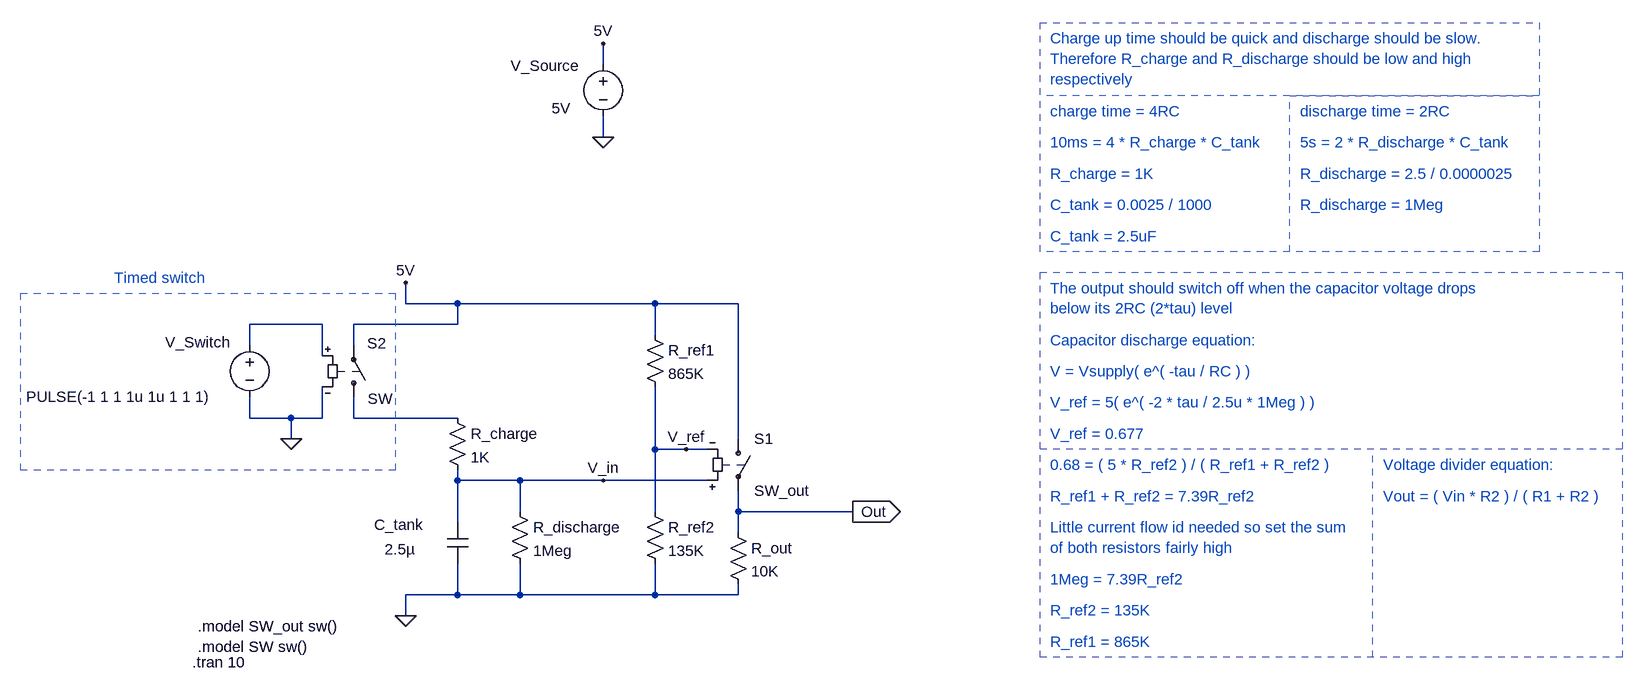
[diagram p0: schematic RC Timer.asc]
RC Timer.asc, the LTspice schematic file:
Version 4
SHEET 1 2388 756
WIRE 0 -480 0 -512
WIRE 0 -368 0 -400
WIRE -304 -112 -304 -144
WIRE -224 -112 -304 -112
WIRE 80 -112 -224 -112
WIRE 208 -112 80 -112
WIRE -432 -80 -544 -80
WIRE -224 -80 -224 -112
WIRE -224 -80 -384 -80
WIRE 80 -64 80 -112
WIRE -544 -48 -544 -80
WIRE -384 -48 -384 -80
WIRE -432 -32 -432 -80
WIRE -544 64 -544 32
WIRE -480 64 -544 64
WIRE -432 64 -432 16
WIRE -432 64 -480 64
WIRE -384 64 -384 32
WIRE -224 64 -384 64
WIRE -480 96 -480 64
WIRE 208 96 208 -112
WIRE 80 112 80 16
WIRE 128 112 80 112
WIRE 160 112 128 112
WIRE -224 160 -224 144
WIRE -128 160 -224 160
WIRE 0 160 -128 160
WIRE 160 160 0 160
WIRE -128 208 -128 160
WIRE 80 208 80 112
WIRE 208 208 208 176
WIRE 384 208 208 208
WIRE -224 224 -224 160
WIRE 208 240 208 208
WIRE -224 336 -224 288
WIRE -224 336 -304 336
WIRE -128 336 -128 288
WIRE -128 336 -224 336
WIRE 80 336 80 288
WIRE 80 336 -128 336
WIRE 208 336 208 320
WIRE 208 336 80 336
WIRE -304 368 -304 336
FLAG -304 -144 5V
FLAG -304 368 0
FLAG 384 208 Out
IOPIN 384 208 Out
FLAG -480 96 0
FLAG 0 -368 0
FLAG 0 -512 5V
FLAG 128 112 V_ref
FLAG 0 160 V_in
SYMBOL sw 208 80 R0
SYMATTR InstName S1
SYMATTR Value SW_out
SYMBOL res 64 -80 R0
SYMATTR InstName R_ref1
SYMATTR Value 865K
SYMBOL res 64 192 R0
SYMATTR InstName R_ref2
SYMATTR Value 135K
SYMBOL cap -240 224 R0
WINDOW 0 -112 4 Left 2
WINDOW 3 -96 42 Left 2
SYMATTR InstName C_tank
SYMATTR Value 2.5µ
SYMBOL res -240 48 R0
SYMATTR InstName R_charge
SYMATTR Value 1K
SYMBOL res 192 224 R0
SYMATTR InstName R_out
SYMATTR Value 10K
SYMBOL sw -384 48 M180
WINDOW 0 21 99 Left 2
WINDOW 3 22 14 Left 2
SYMATTR InstName S2
SYMBOL voltage -544 -64 R0
WINDOW 0 -130 11 Left 2
WINDOW 3 -344 95 Left 2
WINDOW 123 0 0 Left 0
WINDOW 39 0 0 Left 0
SYMATTR InstName V_Switch
SYMATTR Value PULSE(-1 1 1 1u 1u 1 1 1)
SYMBOL voltage 0 -496 R0
WINDOW 0 -142 18 Left 2
WINDOW 3 -79 83 Left 2
WINDOW 123 0 0 Left 0
WINDOW 39 0 0 Left 0
SYMATTR InstName V_Source
SYMATTR Value 5V
SYMBOL res -144 192 R0
SYMATTR InstName R_discharge
SYMATTR Value 1Meg
TEXT -624 416 Left 2 !.model SW sw()
TEXT -632 440 Left 2 !.tran 10
TEXT -752 -152 Left 2 ;Timed switch
TEXT 688 136 Left 2 ;0.68 = ( 5 * R_ref2 ) / ( R_ref1 + R_ref2 )
TEXT 688 184 Left 2 ;R_ref1 + R_ref2 = 7.39R_ref2
TEXT 1200 136 Left 2 ;Voltage divider equation:
TEXT 1200 184 Left 2 ;Vout = ( Vin * R2 ) / ( R1 + R2 )
TEXT 688 232 Left 2 ;Little current flow id needed so set the sum\nof both resistors fairly high
TEXT 688 312 Left 2 ;1Meg = 7.39R_ref2
TEXT 688 360 Left 2 ;R_ref2 = 135K
TEXT 688 408 Left 2 ;R_ref1 = 865K
TEXT 688 -520 Left 2 ;Charge up time should be quick and discharge should be slow.\nTherefore R_charge and R_discharge should be low and high\nrespectively
TEXT 688 -408 Left 2 ;charge time = 4RC
TEXT 688 -360 Left 2 ;10ms = 4 * R_charge * C_tank
TEXT 688 -312 Left 2 ;R_charge = 1K
TEXT 688 -264 Left 2 ;C_tank = 0.0025 / 1000
TEXT 688 -216 Left 2 ;C_tank = 2.5uF
TEXT 1072 -408 Left 2 ;discharge time = 2RC
TEXT 1072 -360 Left 2 ;5s = 2 * R_discharge * C_tank
TEXT 1072 -312 Left 2 ;R_discharge = 2.5 / 0.0000025
TEXT 1072 -264 Left 2 ;R_discharge = 1Meg
TEXT 688 -136 Left 2 ;The output should switch off when the capacitor voltage drops\nbelow its 2RC (2*tau) level
TEXT 688 -56 Left 2 ;Capacitor discharge equation:
TEXT 688 -8 Left 2 ;V = Vsupply( e^( -tau / RC ) )
TEXT 688 40 Left 2 ;V_ref = 5( e^( -2 * tau / 2.5u * 1Meg ) )
TEXT 688 88 Left 2 ;V_ref = 0.677
TEXT -624 384 Left 2 !.model SW_out sw()
LINE Normal 1440 -432 672 -432 2
LINE Normal 1056 -432 1440 -432 2
LINE Normal 1056 -192 1056 -432 2
LINE Normal 1184 432 1184 112 2
LINE Normal 1568 112 672 112 2
RECTANGLE Normal -320 144 -896 -128 2
RECTANGLE Normal 1440 -192 672 -544 2
RECTANGLE Normal 1568 432 672 -160 2

The netlist it stands for:
* RC Timer.asc
S1 5V Out V_in V_ref SW_out
R_ref1 5V V_ref 865K
R_ref2 V_ref 0 135K
C_tank V_in 0 2.5µ
R_charge N002 V_in 1K
R_out Out 0 10K
S2 N002 5V N001 0 SW
V_Switch N001 0 PULSE(-1 1 1 1u 1u 1 1 1)
V_Source 5V 0 5V
R_discharge V_in 0 1Meg
.model SW sw()
.tran 10
* Timed switch
* 0.68 = ( 5 * R_ref2 ) / ( R_ref1 + R_ref2 )
* R_ref1 + R_ref2 = 7.39R_ref2
* Voltage divider equation:
* Vout = ( Vin * R2 ) / ( R1 + R2 )
* Little current flow id needed so set the sum
* of both resistors fairly high
* 1Meg = 7.39R_ref2
* R_ref2 = 135K
* R_ref1 = 865K
* Charge up time should be quick and discharge should be slow.
* Therefore R_charge and R_discharge should be low and high
* respectively
* charge time = 4RC
* 10ms = 4 * R_charge * C_tank
* R_charge = 1K
* C_tank = 0.0025 / 1000
* C_tank = 2.5uF
* discharge time = 2RC
* 5s = 2 * R_discharge * C_tank
* R_discharge = 2.5 / 0.0000025
* R_discharge = 1Meg
* The output should switch off when the capacitor voltage drops
* below its 2RC (2*tau) level
* Capacitor discharge equation:
* V = Vsupply( e^( -tau / RC ) )
* V_ref = 5( e^( -2 * tau / 2.5u * 1Meg ) )
* V_ref = 0.677
.model SW_out sw()
.backanno
.end

* Results of the author's LTspice run, read from the files saved beside the schematic
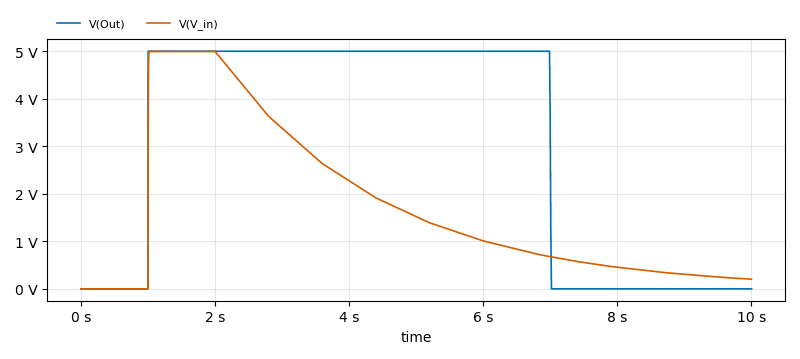
[diagram p1: Transient Analysis of RC Timer.asc, plotted from the saved traces]
* Transient Analysis, 1 run:
*   V(Out): min 0 V, max 5 V, average 3.001 V, rms 3.872 V, last 0 V
*   V(V_in): min 10 µV, max 4.995 V, average 1.706 V, rms 2.388 V, last 203.6 mV